# Altium schematic sheet POWER.SchDoc
size A4; Author: Fernando Vásquez; DrawnBy: Fernando Vásquez; Engineer: Fernando Vásquez; Organization: WATCHING; Address1: Joaquin Pinto E4-358; Address2: y Amazonas; Address3: Quito-Ecuador; Address4: www.watching.com.ec; Revision: FV; Rule: PcbType=ProtelPcb
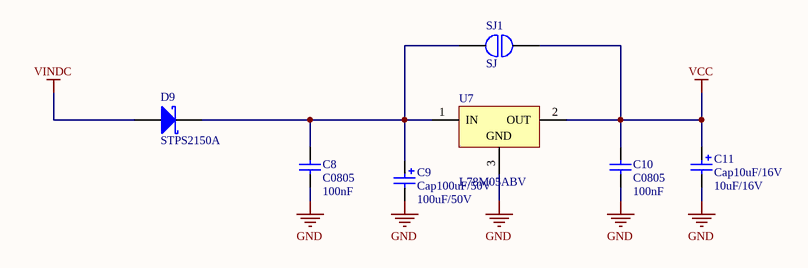
[diagram p0: POWER.SchDoc]

## Parts
?  (no value)  (graphical)
C8  C0805  value 100nF  [C0805C]
C9  Cap100uF/50V  value 100uF/50V  [CapPS]
C10  C0805  value 100nF  [C0805C]
C11  Cap10uF/16V  value 10uF/16V  [C0805T]
D9  STPS2150A  [DSO-C2/X2.3]
SJ1  SJ  [SJ]
U7  L78M05ABV  [TO220V]

## Nets
GND: C8.2 C9.2 C10.2 C11.2 U7.3(GND)
VCC: C10.1 C11.1 SJ1.2 U7.2(OUT)
VINDC: D9.1(A)
NetC8_1: C8.1 C9.1 D9.2(K) SJ1.1 U7.1(IN)

## Notes on the sheet
- Title
- Size:
- Date:
- Number:
- Time:
- Revision:
- Sheet
- of
- Place logo here
- File:

## Library data of the parts
? = Title Block Address(4)_Logo
C8 C10 = Cap 0805 100nF: Cap 100nF 25V X7R; Part: 399-1170-1-ND; Proveedor: Digikey; Published: 8-Jun-2000; LatestRevisionDate: 17-Jul-2002; LatestRevisionNote: Re-released for DXP Platform.; PackageReference: C1206; Publisher: Altium Limited; Price: 0.10
C9 = Cap100uF/50V: Part: P5182-ND; Published: 8-Jun-2000; LatestRevisionDate: 17-Jul-2002; LatestRevisionNote: Re-released for DXP Platform.; PackageReference: RB7.6-15; Publisher: Altium Limited; Price: 0.33
C11 = Cap10uF/16V: Cap Tant 10uF 16V 20% SMD; Part: 511-1473-1-ND; Proveedor: Digikey; Published: 8-Jun-2000; LatestRevisionDate: 17-Jul-2002; LatestRevisionNote: Re-released for DXP Platform.; PackageReference: C0805; Publisher: Altium Limited; Price: 0.65
D9 = STPS2150A: Schottky Rectifier; Part: 497-2467-1-ND; Proveedor: Digikey; Published: 8-Jun-2000; LatestRevisionDate: 17-Jul-2002; LatestRevisionNote: Re-released for DXP Platform.; DatasheetVersion: Dec-1997; PackageReference: DO-204AL; Publisher: Altium Limited; Code_JEDEC: DO-204-AL; ComponentLink1Description: Manufacturer Link; ComponentLink1URL: http://www.irf.com/; ComponentLink2Description: Datasheet; ComponentLink2URL: http://www.irf.com/product-info/datasheets/data/11dq03.pdf; Price: 0.49
SJ1 = SJ: Solder Junction
U7 = L78M05ABV: Precision 500mA Regulator; Note: Tab is connected to pin 3 (GND).; Published: 24-Aug-2001; LatestRevisionDate: 17-Jul-2002; LatestRevisionNote: Re-released for DXP Platform.; DatasheetVersion: Mar-1997; PackageReference: TO220V; Publisher: Altium Limited; PackageDescription: TO, Thru-Hole, Vertical, Heatsink Mounted; 3 In-Line Leads; Pitch 2.54 mm; Pin sequence 1, 3, 2; ComponentLink1Description: Manufacturer Link; ComponentLink1URL: http://www.st.com/; ComponentLink2Description: Datasheet; ComponentLink2URL: http://www.st.com/stonline/products/literature/ds/2147/l78m05ab.pdf